# Altium schematic sheet LED.SchDoc
size A; SheetNumber: 5; SheetTotal: 10
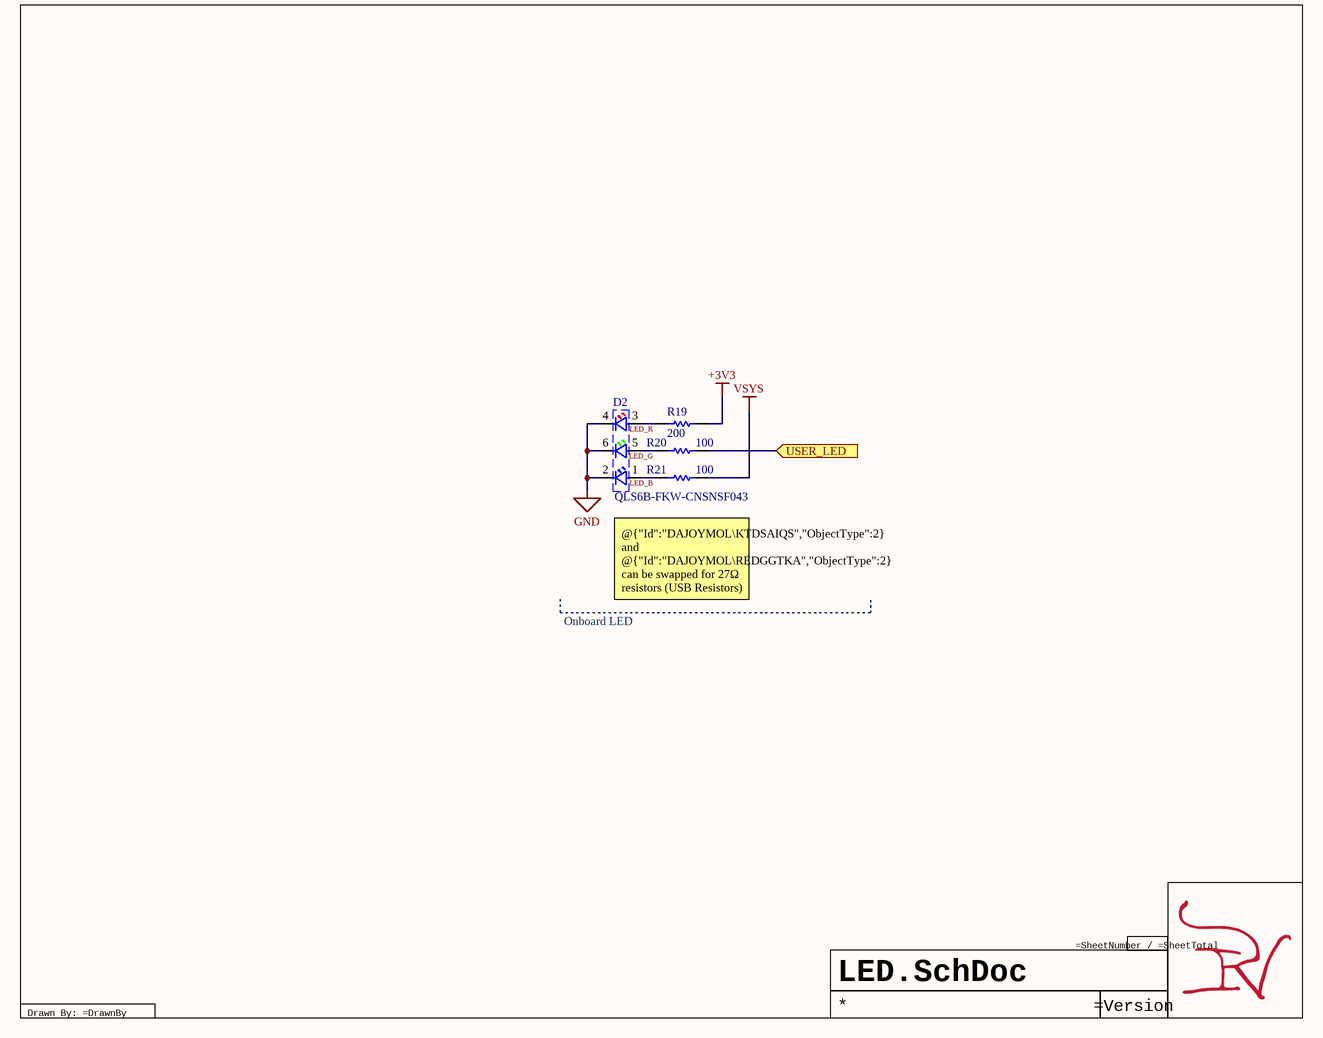
[diagram p0: LED.SchDoc]

## Parts
D2  QLS6B-FKW-CNSNSF043  [LED_QLS6B-FKW-CNSNSF043]
R19  value 200  [RES 0201_0603]  (hidden comment: 200-0201-0.05/1)
R20  value 100  [RES 0201_0603]  (hidden comment: 100-0201-0.05/1)
R21  value 100  [RES 0201_0603]  (hidden comment: 100-0201-0.05/1)

## Ports
USER_LED (in, see 2040Macro-PCB[2C])

## Nets
+3V3: R19.2
GND: D2.2(BLUE_CATHODE) D2.4(RED_CATHODE) D2.6(GREEN_CATHODE)
VSYS: R21.2
LED_B: D2.1(BLUE_ANODE) R21.1
LED_G: D2.5(GREEN_ANODE) R20.1
LED_R: D2.3(RED_ANODE) R19.1
USER_LED: R20.2 ; port USER_LED

## Notes on the sheet
- Onboard LED
- @{"Id":"DAJOYMOL\KTDSAIQS","ObjectType":2} and @{"Id":"DAJOYMOL\REDGGTKA","ObjectType":2} can be swapped for 27Ω resistors (USB Resistors) for ~8mA current if too dim.
- Drawn By: =DrawnBy

## Library data of the parts
D2 = CMP-004-00006-3: Triple Color LED, Red/green/blue; MF: {'manufacturer': u'Cree Inc.'}; Price: None; Design Item ID: QLS6B-FKW-CNSNSF043; MP: QLS6B-FKW-CNSNSF043; Source: QLS6B-FKW-CNSNSF043.SchLib; Value: *; Availability: Unavailable; Case/Package: None
R19 = CMP-009-00055-1: Fixed Resistor, Metal Glaze/thick Film, 0.05W, 200ohm, 25V, 1% +/-Tol, 200ppm/Cel, Surface Mount, 0201; Package Height: 0.23mm; Package Width: 0.3mm; Rated Temperature: 70°C; Power: 50mW; Temperature Coefficient: 200ppm/°C; Package Length: 0.6mm; Reference Standard: AEC-Q200; Package Shape: Rectangular; Reach SVHC Compliant: Yes; Package Style: SMTMeter; Max Operating Temperature: 125°C; Pins: 2; RoHS Compliant: Yes; Termination: Wraparound; Working Voltage: 25V; Terminal Finish: Nickel; Min Operating Temperature: -55°C; Packaging: Tape and Reel; Mounting Technology: Surface Mount; Technology: METAL GLAZE/THICK FILM; Resistor Type: FIXED RESISTOR; JESD-609 Code: e3; Tolerance: 1%; Case/Package: 0201; Construction: Rectangular
R20 R21 = CMP-009-00050-3: Fixed Resistor, Metal Glaze/thick Film, 0.05W, 100ohm, 25V, 1% +/-Tol, 200ppm/Cel, Surface Mount, 0201; Reference Standard: AEC-Q200; Package Height: 0.23mm; Rated Temperature: 70°C; Temperature Coefficient: 200ppm/°C; Package Length: 0.6mm; Power: 50mW; Package Width: 0.3mm; Max Operating Temperature: 125°C; Package Style: SMTMeter; Case/Package: 0201; Reach SVHC Compliant: Yes; JESD-609 Code: e3; Package Shape: Rectangular; Terminal Finish: Nickel; Working Voltage: 25V; Mounting Technology: Surface Mount; Pins: 2; Termination: Wraparound; Construction: Rectangular; Tolerance: 1%; Resistor Type: FIXED RESISTOR; Min Operating Temperature: -55°C; Technology: METAL GLAZE/THICK FILM; RoHS Compliant: Yes; Packaging: Tape and Reel